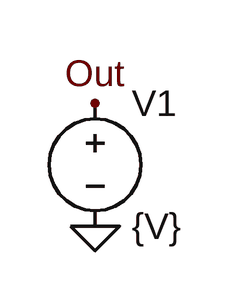
[diagram p0: schematic v_label.asc]
v_label.asc, the LTspice schematic file:
Version 4
SHEET 1 880 680
FLAG 128 192 0
FLAG 128 112 Out
SYMBOL voltage 128 96 R0
SYMATTR InstName V1
SYMATTR Value {V}

The netlist it stands for:
* v_label.asc
V1 Out 0 {V}
.backanno
.end